# Altium schematic sheet Main circuit.SchDoc
size A; SheetNumber: 1; SheetTotal: 1; SPICEModelCacheKAASHNLG: <root> / <DocumentId>KAASHNLG</DocumentId> / <CacheFrame Number="0"> / <Model Name="cap" Kind="MDL"> / <Text>*Default semiconductor capacitor / .MODEL CAP C()</Text> / </Model> / </CacheFrame> / </root>
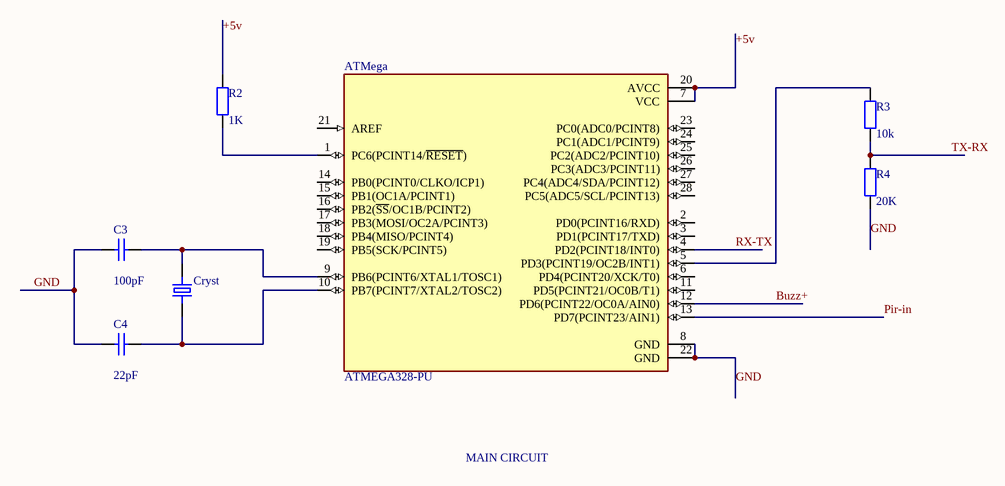
[diagram p0: Main circuit.SchDoc]

## Parts
ATMega  ATMEGA328-PU  [DIP787W46P254L3467H508Q28]
C3  value 100pF  [RAD-0.3]  (hidden comment: Cap)
C4  value 22pF  [RAD-0.3]  (hidden comment: Cap)
Cryst  ECS-160-S-4  [XTAL_ECS-160-20-4X]  (value not drawn)
R2  value 1K  [AXIAL-0.4]  (hidden comment: Res2)
R3  value 10k  [AXIAL-0.4]  (hidden comment: Res2)
R4  value 20K  [AXIAL-0.4]  (hidden comment: Res2)

## Nets
+5v: ATMega.7(VCC) ATMega.20(AVCC) R2.2
Buzz+: ATMega.12(PD6(PCINT22/OC0A/AIN0))
GND: ATMega.8(GND) ATMega.22(GND) C3.1 C4.1 R4.1
Pir-in: ATMega.13(PD7(PCINT23/AIN1))
RX-TX: ATMega.4(PD2(PCINT18/INT0))
TX-RX: R3.1 R4.2
NetATMega_1: ATMega.1(PC6(PCINT14/~{RESET})) R2.1
NetATMega_5: ATMega.5(PD3(PCINT19/OC2B/INT1)) R3.2
NetATMega_9: ATMega.9(PB6(PCINT6/XTAL1/TOSC1)) C3.2 Cryst.2
NetATMega_10: ATMega.10(PB7(PCINT7/XTAL2/TOSC2)) C4.2 Cryst.1

Not connected (* = marked no-connect by the designer): ATMega 2(PD0(PCINT16/RXD)) 3(PD1(PCINT17/TXD)) 6(PD4(PCINT20/XCK/T0)) 11(PD5(PCINT21/OC0B/T1)) 14(PB0(PCINT0/CLKO/ICP1)) 15(PB1(OC1A/PCINT1)) 16(PB2(~{SS}/OC1B/PCINT2)) 17(PB3(MOSI/OC2A/PCINT3)) 18(PB4(MISO/PCINT4)) 19(PB5(SCK/PCINT5)) 21(AREF) 23(PC0(ADC0/PCINT8)) 24(PC1(ADC1/PCINT9)) 25(PC2(ADC2/PCINT10)) 26(PC3(ADC3/PCINT11)) 27(PC4(ADC4/SDA/PCINT12)) 28(PC5(ADC5/SCL/PCINT13))

## Notes on the sheet
- MAIN CIRCUIT

## Library data of the parts
ATMega = ATMEGA328-PU: AVR AVRÂ® ATmega Microcontroller IC 8-Bit 20MHz 32KB (16K x 16) FLASH 28-PDIP; Price: None; MP: ATMEGA328-PU; Availability: Unavailable; Value: *; Package: None
C3 C4 = Cap: Capacitor; Published: 8-Jun-2000; PackageReference: RAD-0.3; Publisher: Altium Limited; PackageDescription: Radial Cap, Thru-Hole; 2 Leads; 0.3 in Pin Spacing; LatestRevisionDate: 17-Jul-2002; LatestRevisionNote: Re-released for DXP Platform.
Cryst = ECS-160-S-4: 16MHz Â±30ppm Crystal Series 40 Ohms HC-49/US; MF: ECS Inc.; SnapEDA_Link: https://www.snapeda.com/parts/ECS-160-S-4/ECS%20Inc./view-part/3657575/?ref=snap; Value: *; Availability: Unavailable; Price: None; MP: ECS-160-S-4; Package: HC49/US ECS International
R2-R4 = Res2: Resistor; Published: 8-Jun-2000; LatestRevisionDate: 17-Jul-2002; LatestRevisionNote: Re-released for DXP Platform.; PackageReference: AXIAL-0.4; Publisher: Altium Limited; PackageDescription: Axial Device, Thru-Hole; 2 Leads; 0.4 in Pin Spacing